# EAGLE board BoardSchem (EAGLE 9.6.2), part 1 of 4
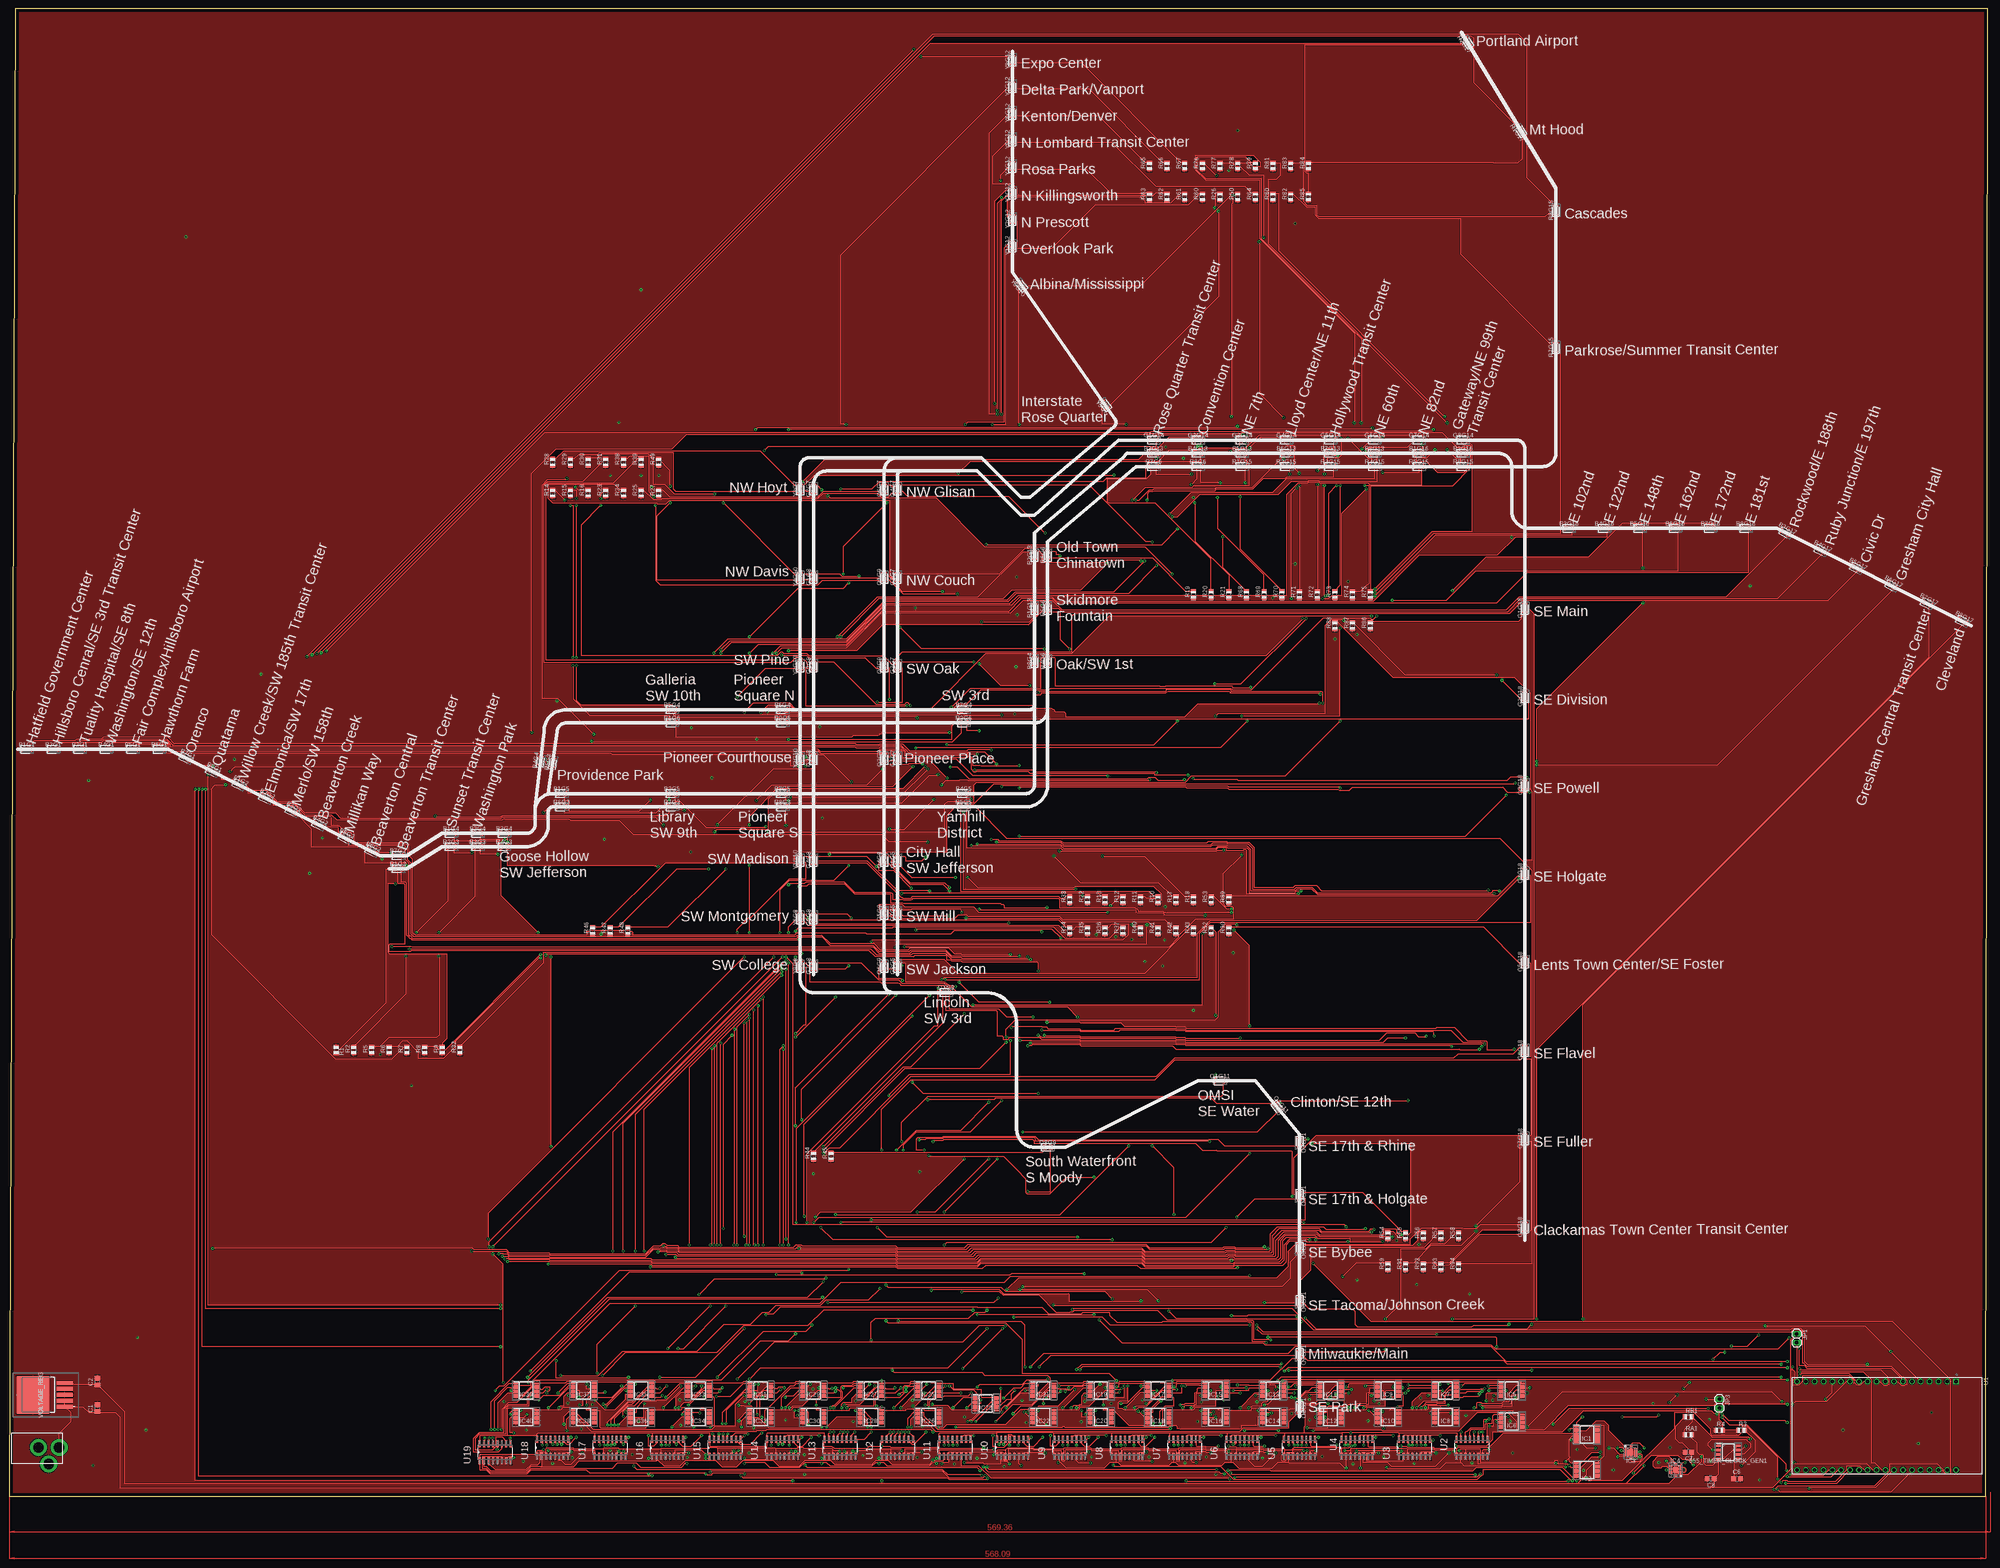
[diagram p22: board, top side]
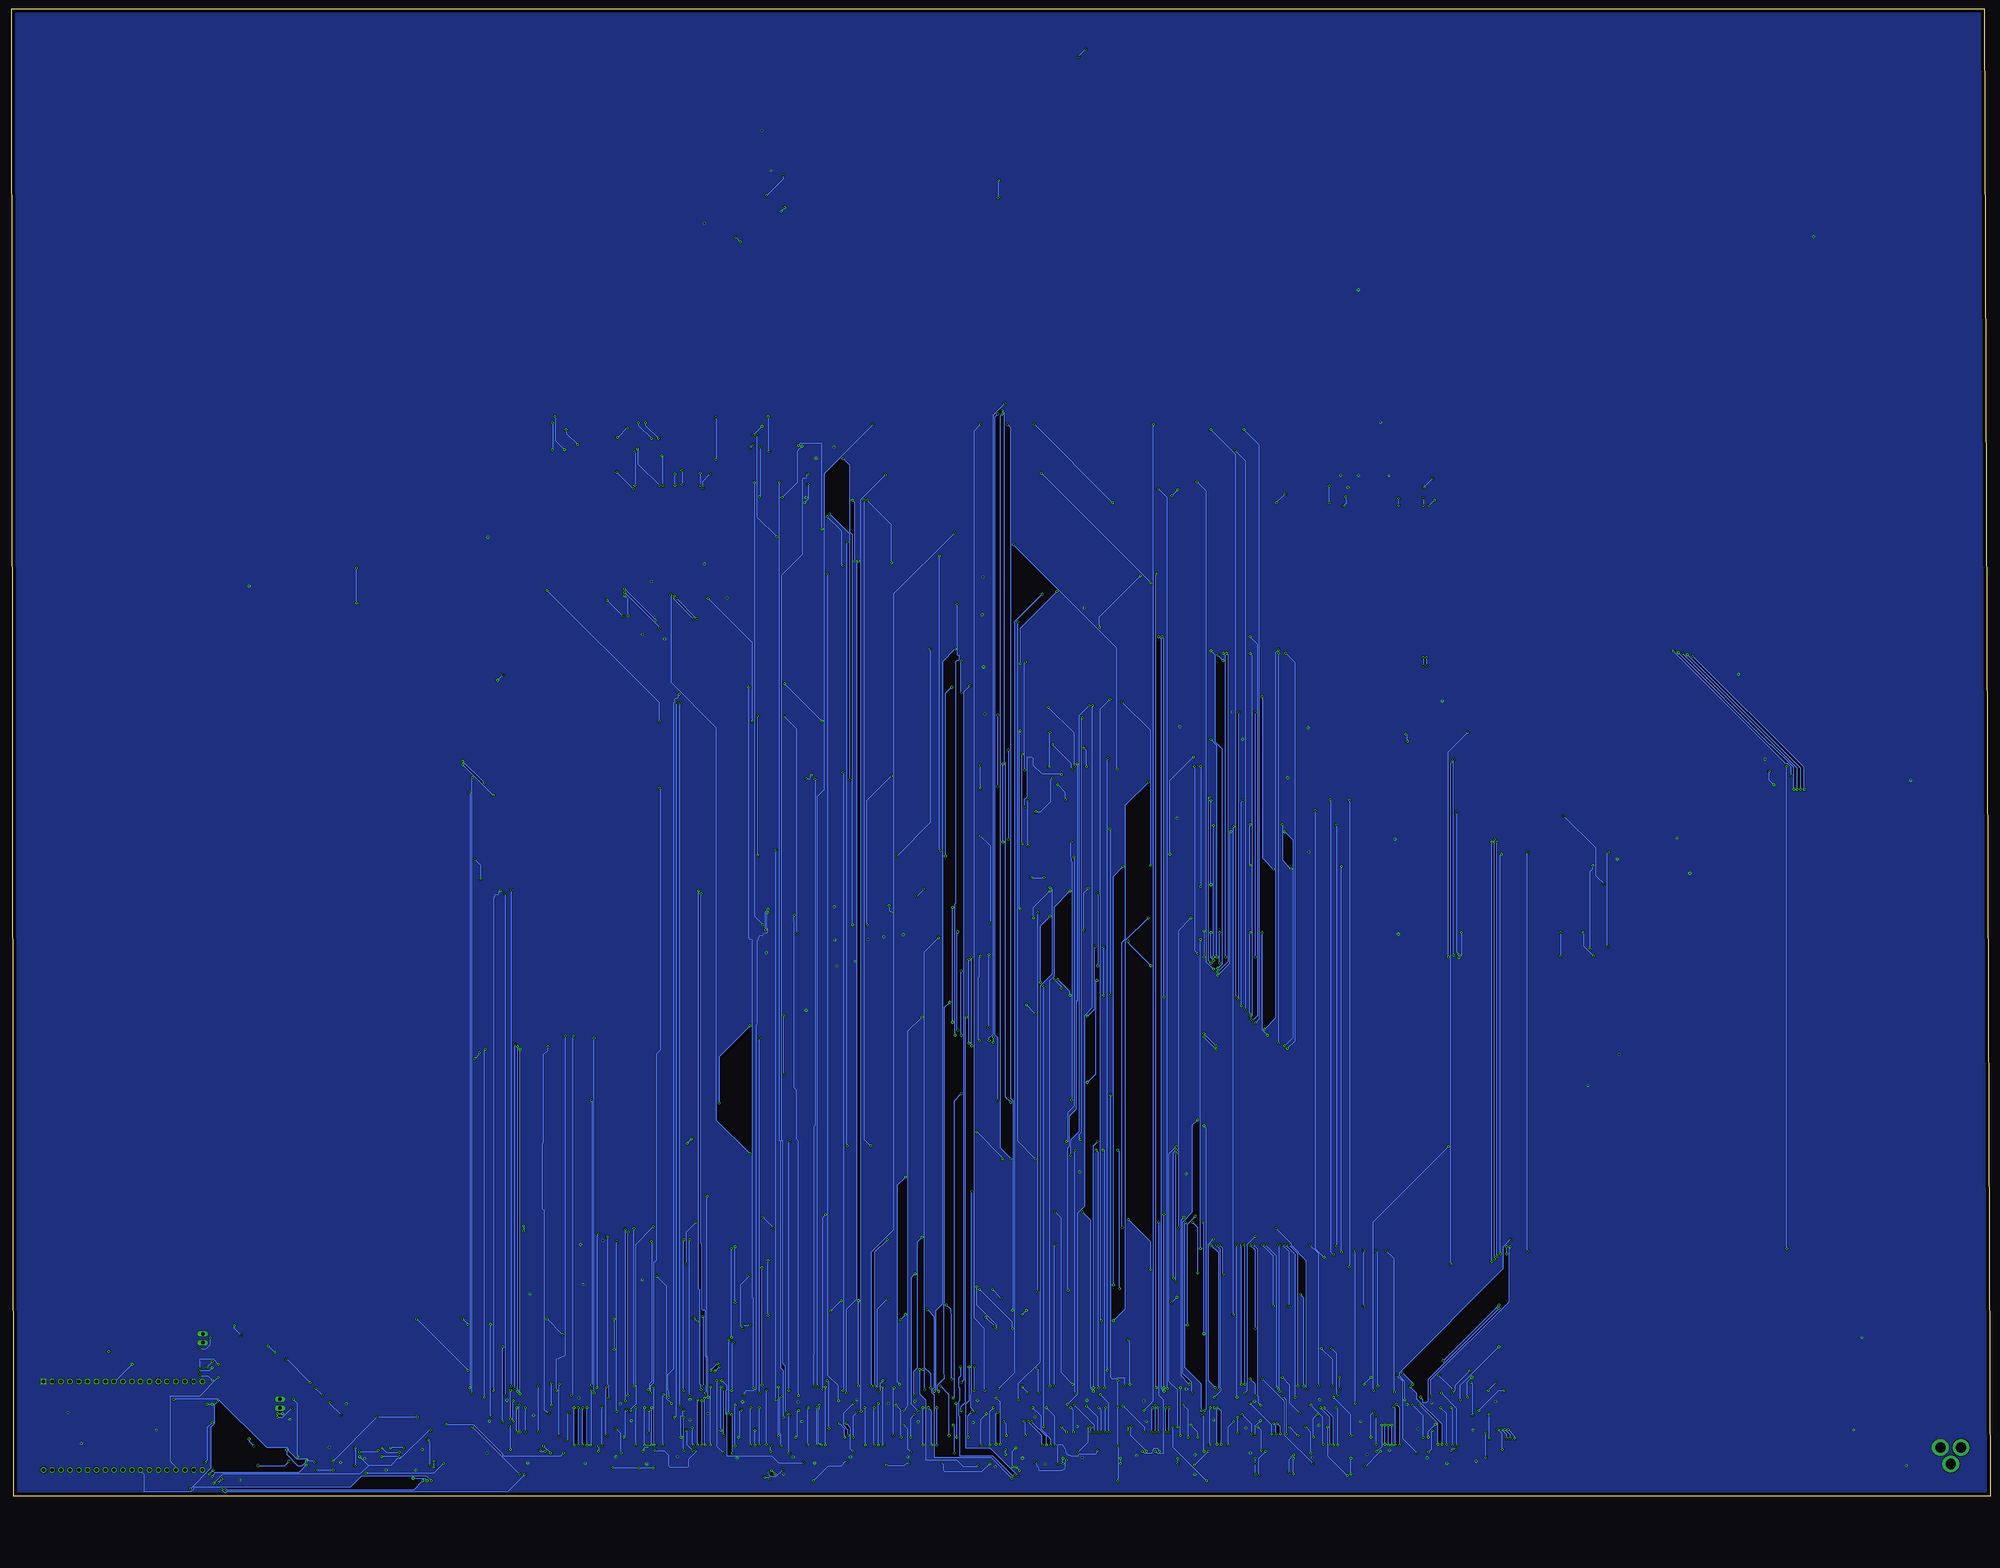
[diagram p23: board, bottom side, seen from below]

Size 568.62 x 427.45 mm. Coordinates in mm from the lower left corner, seen from the top.
Outline: 0,0 568.09,0 568.62,427.45 1.8,427.45 0,0
Copper layers (1*16): Top 0.035mm / dielectric 1.5mm / Bottom 0.035mm
Design rules "default": minimum track width 6mil, minimum drill 0.35mm, track to track 6mil, track to pad 6mil, pad to pad 6mil, via to via 6mil, smd to smd 6mil, copper to edge 40mil, drill to drill 6mil, minimum pad ring 10mil, minimum via ring 8mil, stop-mask expansion 4mil, vias tented up to drill 0mil, thermal gap 10mil
Net classes: 1 5v_power: width 1 mm

## Footprints (pad centres in the part's own frame; a part is rotated, then mirrored left to right if it is on the bottom)
SOIC127P600X175-8N = smd 1.528 x 0.65: 1 -2.711,1.905; 2 -2.711,0.635; 3 -2.711,-0.635; 4 -2.711,-1.905; 5 2.711,-1.905; 6 2.711,-0.635; 7 2.711,0.635; 8 2.711,1.905
LEDC2012X120N = smd 1 x 1.4: 1 -0.9,0; 2 0.9,0
PJ-102A = drill 3 pad 4.8: RING 0.1,-3.39; RING_SW -4.6,-6.29; TIP 0.1,-9.29
C0805 = smd 1.3 x 1.5: 1 -0.95,0; 2 0.95,0
SOP65P640X110-16N = smd 1.475 x 0.45: 1 -2.938,2.275; 2 -2.938,1.625; 3 -2.938,0.975; 4 -2.938,0.325; 5 -2.938,-0.325; 6 -2.938,-0.975; 7 -2.938,-1.625; 8 -2.938,-2.275; 9 2.938,-2.275; 10 2.938,-1.625; 11 2.938,-0.975; 12 2.938,-0.325; 13 2.938,0.325; 14 2.938,0.975; 15 2.938,1.625; 16 2.938,2.275
SOP65P640X110-14N = smd 1.475 x 0.45: 1 -2.938,1.95; 2 -2.938,1.3; 3 -2.938,0.65; 4 -2.938,0; 5 -2.938,-0.65; 6 -2.938,-1.3; 7 -2.938,-1.95; 8 2.938,-1.95; 9 2.938,-1.3; 10 2.938,-0.65; 11 2.938,0; 12 2.938,0.65; 13 2.938,1.3; 14 2.938,1.95
QFN50P250X300X100-15N = smd 0.85 x 0.3: 1 -1.2,1; 2 -1.2,0.5; 3 -1.2,0; 4 -1.2,-0.5; 5 -1.2,-1; 8 1.2,-1; 9 1.2,-0.5; 10 1.2,0; 11 1.2,0.5; 12 1.2,1 | smd 0.3 x 0.85: 6 -0.25,-1.45; 7 0.25,-1.45; 13 0.25,1.45; 14 -0.25,1.45 | smd 1.15 x 1.65: 15 0,0
1X02 = drill 1.016 long: 1 -1.27,0; 2 1.27,0
R0805 = smd 1.1 x 1.4: 1 -1,0; 2 1,0
MODULE_ESP32-DEVKITC-32D = drill 1.04 square: 1 -12.7,19.76 | drill 1.04: 2 -12.7,17.22; 3 -12.7,14.68; 4 -12.7,12.14; 5 -12.7,9.6; 6 -12.7,7.06; 7 -12.7,4.52; 8 -12.7,1.98; 9 -12.7,-0.56; 10 -12.7,-3.1; 11 -12.7,-5.64; 12 -12.7,-8.18; 13 -12.7,-10.72; 14 -12.7,-13.26; 15 -12.7,-15.8; 16 -12.7,-18.34; 17 -12.7,-20.88; 18 -12.7,-23.42; 19 -12.7,-25.96; 20 12.7,19.76; 21 12.7,17.22; 22 12.7,14.68; 23 12.7,12.14; 24 12.7,9.6; 25 12.7,7.06; 26 12.7,4.52; 27 12.7,1.98; 28 12.7,-0.56; 29 12.7,-3.1; 30 12.7,-5.64; 31 12.7,-8.18; 32 12.7,-10.72; 33 12.7,-13.26; 34 12.7,-15.8; 35 12.7,-18.34; 36 12.7,-20.88; 37 12.7,-23.42; 38 12.7,-25.96
SOIC127P600X175-16N = smd 1.981 x 0.559: 1 -2.464,4.445; 2 -2.464,3.175; 3 -2.464,1.905; 4 -2.464,0.635; 5 -2.464,-0.635; 6 -2.464,-1.905; 7 -2.464,-3.175; 8 -2.464,-4.445; 9 2.464,-4.445; 10 2.464,-3.175; 11 2.464,-1.905; 12 2.464,-0.635; 13 2.464,0.635; 14 2.464,1.905; 15 2.464,3.175; 16 2.464,4.445
TLS850B0TBV33ATMA1 = smd 1.1 x 4.6: 1 -3.4,-12.2; 2 -1.7,-12.2; 3 0,-12.2; 4 1.7,-12.2; 5 3.4,-12.2 | smd 10.8 x 9.4: 6 0,-3.05

## Placement (x,y rotation side)
555_TIMER_CLOCK_GEN1  LM555CM_NOPB  [SOIC127P600X175-8N]  494.03,12.7 0 top
B1G1  LTST-C170TBKT  [LEDC2012X120N]  5.08,214.63 0 top
B1G2  LTST-C170TBKT  [LEDC2012X120N]  66.04,204.47 333.5 top
B1G4  LTST-C170TBKT  [LEDC2012X120N]  127,190.5 0 top
B1G5  LTST-C170TBKT  [LEDC2012X120N]  158.75,201.93 0 top
B1G13  LTST-C170TBKT  [LEDC2012X120N]  294.64,255.27 90 top
B1G16  LTST-C170TBKT  [LEDC2012X120N]  405.13,299.72 0 top
B2G1  LTST-C170TBKT  [LEDC2012X120N]  12.7,214.63 0 top
B2G2  LTST-C170TBKT  [LEDC2012X120N]  73.66,200.66 333.5 top
B2G4  LTST-C170TBKT  [LEDC2012X120N]  134.62,190.5 0 top
B2G5  LTST-C170TBKT  [LEDC2012X120N]  190.5,201.93 0 top
B2G13  LTST-C170TBKT  [LEDC2012X120N]  294.64,270.51 90 top
B2G16  LTST-C170TBKT  [LEDC2012X120N]  417.83,299.72 0 top
B3G1  LTST-C170TBKT  [LEDC2012X120N]  20.32,214.63 0 top
B3G2  LTST-C170TBKT  [LEDC2012X120N]  81.28,196.85 333.5 top
B3G4  LTST-C170TBKT  [LEDC2012X120N]  142.24,190.5 0 top
B3G5  LTST-C170TBKT  [LEDC2012X120N]  222.25,201.93 0 top
B3G13  LTST-C170TBKT  [LEDC2012X120N]  328.93,299.72 0 top
B3G16  LTST-C170TBKT  [LEDC2012X120N]  448.31,278.13 0 top
B3G17  LTST-C170TBKT  [LEDC2012X120N]  510.54,276.86 332.9 top
B4G1  LTST-C170TBKT  [LEDC2012X120N]  27.94,214.63 0 top
B4G2  LTST-C170TBKT  [LEDC2012X120N]  88.9,193.04 333.5 top
B4G4  LTST-C170TBKT  [LEDC2012X120N]  152.69,211.32 82.3 top
B4G5  LTST-C170TBKT  [LEDC2012X120N]  274.32,201.93 0 top
B4G13  LTST-C170TBKT  [LEDC2012X120N]  341.63,299.72 0 top
B4G16  LTST-C170TBKT  [LEDC2012X120N]  458.47,278.13 0 top
B4G17  LTST-C170TBKT  [LEDC2012X120N]  520.7,271.78 332.9 top
B5G1  LTST-C170TBKT  [LEDC2012X120N]  35.56,214.63 0 top
B5G2  LTST-C170TBKT  [LEDC2012X120N]  96.52,189.23 333.5 top
B5G4  LTST-C170TBKT  [LEDC2012X120N]  190.5,226.06 0 top
B5G13  LTST-C170TBKT  [LEDC2012X120N]  354.33,299.72 0 top
B5G16  LTST-C170TBKT  [LEDC2012X120N]  468.63,278.13 0 top
B5G17  LTST-C170TBKT  [LEDC2012X120N]  530.86,266.7 332.9 top
B6G1  LTST-C170TBKT  [LEDC2012X120N]  43.18,214.63 0 top
B6G2  LTST-C170TBKT  [LEDC2012X120N]  104.14,185.42 333.5 top
B6G4  LTST-C170TBKT  [LEDC2012X120N]  222.25,226.06 0 top
B6G13  LTST-C170TBKT  [LEDC2012X120N]  367.03,299.72 0 top
B6G16  LTST-C170TBKT  [LEDC2012X120N]  478.79,278.13 0 top
B6G17  LTST-C170TBKT  [LEDC2012X120N]  541.02,261.62 332.9 top
B7G1  LTST-C170TBKT  [LEDC2012X120N]  50.8,212.09 333.5 top
B7G2  LTST-C170TBKT  [LEDC2012X120N]  111.76,184.15 0 top
B7G4  LTST-C170TBKT  [LEDC2012X120N]  274.32,226.06 0 top
B7G13  LTST-C170TBKT  [LEDC2012X120N]  379.73,299.72 0 top
B7G16  LTST-C170TBKT  [LEDC2012X120N]  488.95,278.13 0 top
B7G17  LTST-C170TBKT  [LEDC2012X120N]  551.18,256.54 332.9 top
B8G1  LTST-C170TBKT  [LEDC2012X120N]  58.42,208.28 333.5 top
B8G4  LTST-C170TBKT  [LEDC2012X120N]  294.64,240.03 90 top
B8G13  LTST-C170TBKT  [LEDC2012X120N]  392.43,299.72 0 top
B8G16  LTST-C170TBKT  [LEDC2012X120N]  499.11,278.13 0 top
B8G17  LTST-C170TBKT  [LEDC2012X120N]  561.34,251.46 332.9 top
BARREL_JACK1  2.1MMJACKTHM  [PJ-102A]  5.08,13.97 90 top
C1  .1uF  [C0805]  25.4,25.4 90 top
C2  2.2uF  [C0805]  25.4,33.02 90 top
C6  .01uF  [C0805]  496.57,5.08 0 top
C7  [C0805]  482.6,12.7 180 top
C8  .1uF  [C0805]  488.95,5.08 180 top
G1G7  LTST-C170TBKT  [LEDC2012X120N]  255.27,212.09 90 top
G1G8  LTST-C170TBKT  [LEDC2012X120N]  231.14,264.16 90 top
G1G14  LTST-C170TBKT  [LEDC2012X120N]  328.93,303.53 0 top
G1G18  LTST-C170TBKT  [LEDC2012X120N]  435.61,255.27 90 top
G2G7  LTST-C170TBKT  [LEDC2012X120N]  255.27,238.76 90 top
G2G8  LTST-C170TBKT  [LEDC2012X120N]  231.14,238.76 90 top
G2G14  LTST-C170TBKT  [LEDC2012X120N]  341.63,303.53 0 top
G2G18  LTST-C170TBKT  [LEDC2012X120N]  435.61,229.87 90 top
G3G7  LTST-C170TBKT  [LEDC2012X120N]  255.27,264.16 90 top
G3G8  LTST-C170TBKT  [LEDC2012X120N]  231.14,212.09 90 top
G3G14  LTST-C170TBKT  [LEDC2012X120N]  354.33,303.53 0 top
G3G18  LTST-C170TBKT  [LEDC2012X120N]  435.61,204.47 90 top
G4G7  LTST-C170TBKT  [LEDC2012X120N]  255.27,289.56 90 top
G4G8  LTST-C170TBKT  [LEDC2012X120N]  231.14,182.88 90 top
G4G14  LTST-C170TBKT  [LEDC2012X120N]  367.03,303.53 0 top
G4G18  LTST-C170TBKT  [LEDC2012X120N]  435.61,179.07 90 top
G5G8  LTST-C170TBKT  [LEDC2012X120N]  231.14,166.37 90 top
G5G14  LTST-C170TBKT  [LEDC2012X120N]  379.73,303.53 0 top
G5G18  LTST-C170TBKT  [LEDC2012X120N]  435.61,153.67 90 top
G6G5  LTST-C170TBKT  [LEDC2012X120N]  255.27,182.88 90 top
G6G14  LTST-C170TBKT  [LEDC2012X120N]  392.43,303.53 0 top
G6G18  LTST-C170TBKT  [LEDC2012X120N]  435.61,128.27 90 top
G7G5  LTST-C170TBKT  [LEDC2012X120N]  255.27,167.64 90 top
G7G7  LTST-C170TBKT  [LEDC2012X120N]  231.14,289.56 90 top
G7G8  LTST-C170TBKT  [LEDC2012X120N]  231.14,152.4 90 top
G7G14  LTST-C170TBKT  [LEDC2012X120N]  405.13,303.53 0 top
G7G18  LTST-C170TBKT  [LEDC2012X120N]  435.61,102.87 90 top
G8G5  LTST-C170TBKT  [LEDC2012X120N]  255.27,152.4 90 top
G8G14  LTST-C170TBKT  [LEDC2012X120N]  417.83,303.53 0 top
G8G18  LTST-C170TBKT  [LEDC2012X120N]  435.61,77.47 90 top
IC1  74HC390PW,118  [SOP65P640X110-16N]  453.39,17.78 0 top
IC2  74ALVC04PW,118  [SOP65P640X110-14N]  453.39,7.62 0 top
IC3  74ALVC08BQ,115  [QFN50P250X300X100-15N]  466.09,12.7 0 top
IC4  74ALVC08BQ,115  [QFN50P250X300X100-15N]  478.79,7.62 180 top
IC5  74ALVC04PW,118  [SOP65P640X110-14N]  431.8,30.48 0 top
IC6  74ALVC04PW,118  [SOP65P640X110-14N]  431.8,21.59 0 top
IC7  74ALVC04PW,118  [SOP65P640X110-14N]  412.75,30.48 0 top
IC8  74ALVC04PW,118  [SOP65P640X110-14N]  412.75,22.86 0 top
IC9  74ALVC04PW,118  [SOP65P640X110-14N]  396.24,30.48 0 top
IC10  74ALVC04PW,118  [SOP65P640X110-14N]  396.24,22.86 0 top
IC11  74ALVC04PW,118  [SOP65P640X110-14N]  379.73,30.48 0 top
IC12  74ALVC04PW,118  [SOP65P640X110-14N]  379.73,22.86 0 top
IC13  74ALVC04PW,118  [SOP65P640X110-14N]  363.22,30.48 0 top
IC14  74ALVC04PW,118  [SOP65P640X110-14N]  363.22,22.86 0 top
IC15  74ALVC04PW,118  [SOP65P640X110-14N]  346.71,30.48 0 top
IC16  74ALVC04PW,118  [SOP65P640X110-14N]  346.71,22.86 0 top
IC17  74ALVC04PW,118  [SOP65P640X110-14N]  330.2,30.48 0 top
IC18  74ALVC04PW,118  [SOP65P640X110-14N]  330.2,22.86 0 top
IC19  74ALVC04PW,118  [SOP65P640X110-14N]  313.69,30.48 0 top
IC20  74ALVC04PW,118  [SOP65P640X110-14N]  313.69,22.86 0 top
IC21  74ALVC04PW,118  [SOP65P640X110-14N]  297.18,30.48 0 top
IC22  74ALVC04PW,118  [SOP65P640X110-14N]  297.18,22.86 0 top
IC23  74ALVC04PW,118  [SOP65P640X110-14N]  280.67,26.67 0 top
IC25  74ALVC04PW,118  [SOP65P640X110-14N]  264.16,30.48 0 top
IC26  74ALVC04PW,118  [SOP65P640X110-14N]  264.16,22.86 0 top
IC27  74ALVC04PW,118  [SOP65P640X110-14N]  247.65,30.48 0 top
IC28  74ALVC04PW,118  [SOP65P640X110-14N]  247.65,22.86 0 top
IC29  74ALVC04PW,118  [SOP65P640X110-14N]  231.14,30.48 0 top
IC30  74ALVC04PW,118  [SOP65P640X110-14N]  231.14,22.86 0 top
IC31  74ALVC04PW,118  [SOP65P640X110-14N]  215.9,30.48 0 top
IC32  74ALVC04PW,118  [SOP65P640X110-14N]  215.9,22.86 0 top
IC33  74ALVC04PW,118  [SOP65P640X110-14N]  198.12,30.48 0 top
IC34  74ALVC04PW,118  [SOP65P640X110-14N]  198.12,22.86 0 top
IC35  74ALVC04PW,118  [SOP65P640X110-14N]  181.61,30.48 0 top
IC36  74ALVC04PW,118  [SOP65P640X110-14N]  181.61,22.86 0 top
IC37  74ALVC04PW,118  [SOP65P640X110-14N]  165.1,30.48 0 top
IC38  74ALVC04PW,118  [SOP65P640X110-14N]  165.1,22.86 0 top
IC39  74ALVC04PW,118  [SOP65P640X110-14N]  148.59,30.48 0 top
IC40  74ALVC04PW,118  [SOP65P640X110-14N]  148.59,22.86 0 top
JP1  [1X02]  513.72,45.47 270 top
JP3  [1X02]  491.49,26.67 270 top
O1G9  LTST-C170TBKT  [LEDC2012X120N]  251.46,264.16 90 top
O1G11  LTST-C170TBKT  [LEDC2012X120N]  347.98,119.38 0 top
O2G9  LTST-C170TBKT  [LEDC2012X120N]  251.46,238.76 90 top
O2G11  LTST-C170TBKT  [LEDC2012X120N]  364.49,111.76 308.9 top
O3G9  LTST-C170TBKT  [LEDC2012X120N]  251.46,212.09 90 top
O3G11  LTST-C170TBKT  [LEDC2012X120N]  370.84,101.6 270 top
O4G9  LTST-C170TBKT  [LEDC2012X120N]  251.46,182.88 90 top
O4G11  LTST-C170TBKT  [LEDC2012X120N]  370.84,86.36 270 top
O5G9  LTST-C170TBKT  [LEDC2012X120N]  251.46,167.64 90 top
O5G11  LTST-C170TBKT  [LEDC2012X120N]  370.84,71.12 270 top
O6G7  LTST-C170TBKT  [LEDC2012X120N]  251.46,289.56 90 top
O6G9  LTST-C170TBKT  [LEDC2012X120N]  251.46,152.4 90 top
O6G11  LTST-C170TBKT  [LEDC2012X120N]  370.84,55.88 270 top
O7G9  LTST-C170TBKT  [LEDC2012X120N]  269.24,144.78 0 top
O7G11  LTST-C170TBKT  [LEDC2012X120N]  370.84,40.64 270 top
O8G9  LTST-C170TBKT  [LEDC2012X120N]  298.45,100.33 0 top
O8G11  LTST-C170TBKT  [LEDC2012X120N]  370.84,25.4 270 top
R1  50  [R0805]  93.98,128.27 270 top
R1G3  LTST-C170TBKT  [LEDC2012X120N]  111.76,180.34 0 top
R1G6  LTST-C170TBKT  [LEDC2012X120N]  190.5,222.25 0 top
R1G15  LTST-C170TBKT  [LEDC2012X120N]  354.33,295.91 0 top
R1G17  LTST-C170TBKT  [LEDC2012X120N]  434.34,392.43 124.3 top
R2  50  [R0805]  99.06,128.27 90 top
R2G3  LTST-C170TBKT  [LEDC2012X120N]  127,186.69 0 top
R2G6  LTST-C170TBKT  [LEDC2012X120N]  222.25,222.25 0 top
R2G15  LTST-C170TBKT  [LEDC2012X120N]  367.03,295.91 0 top
R2G17  LTST-C170TBKT  [LEDC2012X120N]  419.1,417.83 124.2 top
R3  50  [R0805]  497.84,19.05 0 top
R3G3  LTST-C170TBKT  [LEDC2012X120N]  134.62,186.69 0 top
R3G6  LTST-C170TBKT  [LEDC2012X120N]  274.32,222.25 0 top
R3G15  LTST-C170TBKT  [LEDC2012X120N]  379.73,295.91 0 top
R4  128  [R0805]  491.49,19.05 0 top
R4G3  LTST-C170TBKT  [LEDC2012X120N]  142.24,186.69 0 top
R4G6  LTST-C170TBKT  [LEDC2012X120N]  298.45,240.03 90 top
R4G15  LTST-C170TBKT  [LEDC2012X120N]  392.43,295.91 0 top
R5  50  [R0805]  104.14,128.27 90 top
R5G3  LTST-C170TBKT  [LEDC2012X120N]  156.21,210.82 81.1 top
R5G5  LTST-C170TBKT  [LEDC2012X120N]  274.32,198.12 0 top
R5G6  LTST-C170TBKT  [LEDC2012X120N]  298.45,255.27 90 top
R5G15  LTST-C170TBKT  [LEDC2012X120N]  405.13,295.91 0 top
R6  50  [R0805]  109.22,128.27 90 top
R6G3  LTST-C170TBKT  [LEDC2012X120N]  158.75,198.12 0 top
R6G6  LTST-C170TBKT  [LEDC2012X120N]  298.45,270.51 90 top
R6G15  LTST-C170TBKT  [LEDC2012X120N]  417.83,295.91 0 top
R7  50  [R0805]  114.3,128.27 90 top
R7G3  LTST-C170TBKT  [LEDC2012X120N]  190.5,198.12 0 top
R7G6  LTST-C170TBKT  [LEDC2012X120N]  328.93,295.91 0 top
R7G15  LTST-C170TBKT  [LEDC2012X120N]  444.5,330.2 90 top
R8  50  [R0805]  119.38,128.27 90 top
R8G3  LTST-C170TBKT  [LEDC2012X120N]  222.25,198.12 0 top
R8G6  LTST-C170TBKT  [LEDC2012X120N]  341.63,295.91 0 top
R8G15  LTST-C170TBKT  [LEDC2012X120N]  444.5,369.57 90 top
R9  50  [R0805]  124.46,128.27 90 top
R10  50  [R0805]  330.2,171.45 90 top
R11  50  [R0805]  325.12,171.45 90 top
R12  50  [R0805]  320.04,171.45 90 top
R13  50  [R0805]  314.96,171.45 90 top
R14  50  [R0805]  156.21,288.29 90 top
R15  50  [R0805]  161.29,288.29 90 top
R16  50  [R0805]  166.37,288.29 90 top
R17  50  [R0805]  335.28,171.45 90 top
R18  50  [R0805]  340.36,171.45 90 top
R19  50  [R0805]  340.36,259.08 90 top
R20  50  [R0805]  345.44,259.08 90 top
R21  50  [R0805]  350.52,259.08 90 top
R22  50  [R0805]  309.88,171.45 90 top
R23  50  [R0805]  171.45,288.29 90 top
R24  50  [R0805]  176.53,288.29 90 top
R25  50  [R0805]  181.61,288.29 90 top
R26  50  [R0805]  347.98,373.38 90 top
R27  50  [R0805]  186.69,288.29 90 top
R28  50  [R0805]  156.21,297.18 90 top
R29  50  [R0805]  161.29,297.18 90 top
R30  50  [R0805]  166.37,297.18 90 top
R31  50  [R0805]  171.45,297.18 90 top
R32  50  [R0805]  129.54,128.27 90 top
R33  50  [R0805]  304.8,171.45 90 top
R34  50  [R0805]  304.8,162.56 90 top
R35  50  [R0805]  309.88,162.56 90 top
R36  50  [R0805]  314.96,162.56 90 top
R37  50  [R0805]  320.04,162.56 90 top
R38  50  [R0805]  176.53,297.18 90 top
R39  50  [R0805]  181.61,297.18 90 top
R40  50  [R0805]  325.12,162.56 90 top
R41  50  [R0805]  330.2,162.56 90 top
R42  50  [R0805]  335.28,162.56 90 top
R43  50  [R0805]  340.36,162.56 90 top
R44  50  [R0805]  231.14,97.79 90 top
R45  50  [R0805]  236.22,97.79 90 top
R46  50  [R0805]  167.64,162.56 90 top
R47  50  [R0805]  172.72,162.56 90 top
R48  50  [R0805]  177.8,162.56 90 top
R49  50  [R0805]  186.69,297.18 90 top
R50  50  [R0805]  353.06,373.38 90 top
R52  50  [R0805]  345.44,162.56 90 top
R53  50  [R0805]  345.44,171.45 90 top
R54  50  [R0805]  396.24,74.93 90 top
R55  50  [R0805]  401.32,74.93 90 top
R56  50  [R0805]  406.4,74.93 90 top
R57  50  [R0805]  411.48,74.93 90 top
R58  50  [R0805]  416.56,74.93 90 top
R59  50  [R0805]  396.24,66.04 90 top
R60  50  [R0805]  342.9,373.38 90 top
R61  50  [R0805]  337.82,373.38 90 top
R62  50  [R0805]  332.74,373.38 90 top
R63  50  [R0805]  327.66,373.38 90 top
R64  50  [R0805]  358.14,373.38 90 top
R65  50  [R0805]  327.66,382.27 90 top
R66  50  [R0805]  332.74,382.27 90 top
R67  50  [R0805]  337.82,382.27 90 top
R68  50  [R0805]  355.6,259.08 90 top
R69  50  [R0805]  360.68,259.08 90 top
R70  50  [R0805]  365.76,259.08 90 top
R71  50  [R0805]  370.84,259.08 90 top
R72  50  [R0805]  375.92,259.08 90 top
R73  50  [R0805]  381,259.08 90 top
R74  50  [R0805]  386.08,259.08 90 top
R75  50  [R0805]  391.16,259.08 90 top
R76  50  [R0805]  342.9,382.27 90 top
R77  50  [R0805]  347.98,382.27 90 top
R78  50  [R0805]  353.06,382.27 90 top
R79  50  [R0805]  358.14,382.27 90 top
R80  50  [R0805]  363.22,373.38 90 top
R81  50  [R0805]  363.22,382.27 90 top
R82  50  [R0805]  368.3,373.38 90 top
R83  50  [R0805]  368.3,382.27 90 top
R84  50  [R0805]  373.38,382.27 90 top
R85  50  [R0805]  373.38,373.38 90 top
R86  50  [R0805]  391.16,250.19 90 top
R87  50  [R0805]  386.08,250.19 90 top
R88  50  [R0805]  381,250.19 90 top
R89  50  [R0805]  350.52,171.45 90 top
R90  50  [R0805]  350.52,162.56 90 top
R91  50  [R0805]  401.32,66.04 90 top
R92  50  [R0805]  406.4,66.04 90 top
R93  50  [R0805]  411.48,66.04 90 top
R94  50  [R0805]  416.56,66.04 90 top
RA1  [R0805]  482.6,17.78 0 top
RB1  [R0805]  482.6,22.86 0 top
U1  ESP32-DEVKITC-32D  [MODULE_ESP32-DEVKITC-32D]  539.75,20.32 270 top
U2  74LCX138MX  [SOIC127P600X175-16N]  420.37,13.97 90 top
U3  74LCX138MX  [SOIC127P600X175-16N]  403.86,13.97 90 top
U4  74LCX138MX  [SOIC127P600X175-16N]  387.35,13.97 90 top
U5  74LCX138MX  [SOIC127P600X175-16N]  370.84,13.97 90 top
U6  74LCX138MX  [SOIC127P600X175-16N]  354.33,13.97 90 top
U7  74LCX138MX  [SOIC127P600X175-16N]  337.82,13.97 90 top
U8  74LCX138MX  [SOIC127P600X175-16N]  321.31,13.97 90 top
U9  74LCX138MX  [SOIC127P600X175-16N]  304.8,13.97 90 top
U10  74LCX138MX  [SOIC127P600X175-16N]  288.29,13.97 90 top
U11  74LCX138MX  [SOIC127P600X175-16N]  271.78,13.97 90 top
U12  74LCX138MX  [SOIC127P600X175-16N]  255.27,13.97 90 top
U13  74LCX138MX  [SOIC127P600X175-16N]  238.76,13.97 90 top
U14  74LCX138MX  [SOIC127P600X175-16N]  222.25,13.97 90 top
U15  74LCX138MX  [SOIC127P600X175-16N]  205.74,13.97 90 top
U16  74LCX138MX  [SOIC127P600X175-16N]  189.23,13.97 90 top
U17  74LCX138MX  [SOIC127P600X175-16N]  172.72,13.97 90 top
U18  74LCX138MX  [SOIC127P600X175-16N]  156.21,13.97 90 top
U19  74LCX138MX  [SOIC127P600X175-16N]  139.7,12.7 90 top
VOLTAGE_REG  TLS850B0TBV33ATMA1  [TLS850B0TBV33ATMA1]  3.81,29.21 90 top
Y1G10  LTST-C170TBKT  [LEDC2012X120N]  227.33,182.88 90 top
Y1G12  LTST-C170TBKT  [LEDC2012X120N]  288.29,359.41 90 top
Y2G10  LTST-C170TBKT  [LEDC2012X120N]  227.33,212.09 90 top
Y2G12  LTST-C170TBKT  [LEDC2012X120N]  288.29,367.03 90 top
Y3G10  LTST-C170TBKT  [LEDC2012X120N]  227.33,238.76 90 top
Y3G12  LTST-C170TBKT  [LEDC2012X120N]  288.29,374.65 90 top
Y4G10  LTST-C170TBKT  [LEDC2012X120N]  227.33,264.16 90 top
Y4G12  LTST-C170TBKT  [LEDC2012X120N]  288.29,382.27 90 top
Y5G7  LTST-C170TBKT  [LEDC2012X120N]  314.96,313.69 127.7 top
Y5G10  LTST-C170TBKT  [LEDC2012X120N]  290.83,347.98 127.7 top
Y5G12  LTST-C170TBKT  [LEDC2012X120N]  288.29,389.89 90 top
Y6G8  LTST-C170TBKT  [LEDC2012X120N]  227.33,166.37 90 top
Y6G12  LTST-C170TBKT  [LEDC2012X120N]  288.29,397.51 90 top
Y7G12  LTST-C170TBKT  [LEDC2012X120N]  288.29,405.13 90 top
Y8G7  LTST-C170TBKT  [LEDC2012X120N]  227.33,289.56 90 top
Y8G8  LTST-C170TBKT  [LEDC2012X120N]  227.33,152.4 90 top
Y8G12  LTST-C170TBKT  [LEDC2012X120N]  288.29,412.75 90 top

## Tracks (layer width: path | path; a pad name or v marks a point on that pad's centre or on a via)
+3V3  (via drill 0.35)
  Top 0.152: 250.75,3.81 33.02,3.81 33.02,24.45 C2.1 18.73,32.07 18.27,32.52 18.25,32.5 16.25,32.5 VOLTAGE_REG.5 | 250.75,3.81 450.85,3.81 | 450.85,3.81 453.39,6.35 453.39,7.62 455.34,9.57 IC2.14 458.47,11.71 458.47,20.32 456.59,20.32 IC1.16 | IC4.14 478.92,6.05 478.92,5.65 477.08,3.81 464.82,3.81 | 450.85,3.81 464.82,3.81 | 464.82,3.81 v469.9,8.89 | IC3.14 465.96,14.27 465.96,14.67 466.53,15.24 468.63,15.24 v469.9,13.97 | IC21.14 300.25,32.5 308.5,32.5 308.75,32.75 308.75,33 314.25,33 314.5,32.75 314.5,32.5 316.5,32.5 IC19.14 316.75,32.5 318.75,32.5 319,32.75 319,33 330.75,33 331,32.75 331,32.5 333,32.5 IC17.14 333.25,32.5 335.25,32.5 335.5,32.75 335.5,33 349,33 | 349,33 349.25,32.75 349.25,32.5 349.5,32.5 IC15.14 | 349,33 362.5,33 362.5,32.75 362.75,32.5 366,32.5 IC13.14 366.25,32.5 366.5,32.5 366.5,32.75 366.75,33 382.5,33 | 382.5,33 382.5,32.5 IC11.14 | 399,33 399,32.5 IC9.14 | 382.5,33 399,33 | 415.5,33 415.5,32.5 | 399,33 415.5,33 | 415.5,33 434.5,33 434.5,32.5 IC5.14 | IC22.14 300.25,24.75 307.25,24.75 307.5,25 307.5,25.25 307.75,25.5 314.25,25.5 314.5,25.25 314.5,24.75 316.5,24.75 IC20.14 316.75,24.75 317.5,24.75 322,20.25 331.25,20.25 331.5,20.5 331.5,24.75 333,24.75 IC18.14 333.25,24.75 340.25,24.75 340.5,25 340.5,25.25 340.75,25.5 347.25,25.5 347.5,25.25 347.5,24.75 349.5,24.75 IC16.14 349.75,24.75 357,24.75 357,25.25 357.25,25.5 361.75,25.5 361.75,25 362,24.75 366,24.75 IC14.14 366.25,24.75 367.75,24.75 368,25 369.75,25 370,25.25 371.75,25.25 372,25 372.25,25 372.5,24.75 372.5,20.25 372.25,20 372.25,18.25 | IC12.14 382.75,24.75 v385.5,24.75 389.75,24.75 390,25 390,25.25 390.25,25.5 396.75,25.5 397,25.25 397,24.75 399,24.75 IC10.14 399.25,24.75 407.5,24.75 407.75,25 407.75,26 411.25,26
  Top 0.152: IC6.14 434.5,23.5 432.25,23.5 432,23.75 432,24.75 415.75,24.75 IC8.14 415.5,24.75 411.5,24.75 411.5,25.75 411.25,26 | 383,18.25 383,16.5 U4.16 | 399.25,18.25 v385.5,18.25 383,18.25 | 399.25,18.25 399.5,18 399.5,16.5 U3.16 | 399.25,18.25 416,18.25 416,16.5 U2.16 | 283.75,18.25 283.75,16.5 U10.16 | 300,18.25 283.75,18.25 | 300,18.25 300.25,18 300.25,16.5 U9.16 | 316.75,18.25 316.75,16.5 U8.16 | 300,18.25 316.75,18.25 | 333.5,18.25 333.5,16.5 U7.16 | 316.75,18.25 333.5,18.25 | 350,18.25 350,16.5 U6.16 | 333.5,18.25 350,18.25 | 366.5,18.25 366.5,16.5 U5.16 | 350,18.25 366.5,18.25 | 366.5,18.25 372.25,18.25 | 372.25,18.25 383,18.25 | v413.5,32.5 415.5,32.5 | v413.5,26.25 411.5,26.25 411.25,26 | 415.5,32.5 IC7.14 | 167.5,33 160.25,33 159.75,32.5 151.75,32.5 IC39.14 | 167.5,33 167.75,32.75 167.75,32.5 168,32.5 IC37.14 | 184.5,33 184.5,32.5 IC35.14 | 167.5,33 184.5,33 | 184.5,33 196.75,33 197,32.75 197.25,32.75 197.5,32.5 201,32.5 IC33.14 201.25,32.5 210.5,32.5 211,33 216.5,33 216.75,32.75 216.75,32.5 218.75,32.5 IC31.14 219,32.5 225.75,32.5 226,32.75 226,33 231.75,33 232,32.75 232,32.5 234,32.5 IC29.14 234.25,32.5 242.25,32.5 242.5,32.75 242.5,33 248.25,33 248.5,32.75 248.5,32.5 250.5,32.5 IC27.14 250.75,32.5 | 250.75,32.5 258.75,32.5 259,32.75 259,33 264.75,33 265,32.75 265,32.5 267,32.5 IC25.14 267.25,32.5 271.25,32.5 271.25,31.25 271.5,31 277.75,31 278,30.75 279.25,30.75 279.25,28.75 279.5,28.5 283.5,28.5 IC23.14 | IC34.14 201,24.75 198.75,24.75 198.75,25.25 198.5,25.5 193.25,25.5 193.25,25 193,24.75 184.75,24.75 IC36.14 184.5,24.75 183.25,24.75 183,24.5 183,19.75 170,19.75 169.75,20 169.75,24.75 168.25,24.75 IC38.14 168,24.75 166,24.75 166,25.25 165.75,25.5 159,25.5 158.75,25.25 158.75,25 158.5,24.75 151.75,24.75 IC40.14 151.5,25 151.25,25.25 149.75,25.25 149.5,25.5 143.5,25.5 143.25,25.25 143.25,17.5
  Top 0.152: 151.5,17.5 143.25,17.5 | 143.25,17.5 135.25,17.5 135.25,15.25 U19.16 | 151.5,17.5 151.75,17.25 151.75,16.5 U18.16 | 168.25,18.25 168.25,16.5 U17.16 | 168.25,18.25 152,18.25 151.75,18 151.75,17.5 151.5,17.5 | 184.75,18.25 184.75,16.5 U16.16 | 168.25,18.25 184.75,18.25 | 184.75,18.25 201.25,18.25 201.25,16.5 U15.16 201.25,16.25 201.25,14.75 201.5,14.5 217.75,14.5 217.75,16.25 U14.16 217.75,16.5 217.75,18 218,18.25 234.25,18.25 234.25,16.5 U13.16 234.25,16.25 234.25,14.25 236.5,14.25 236.75,14 237,14 237.25,13.75 246.5,13.75 247,14.25 250.75,14.25 | IC32.14 219,24.75 224.75,24.75 225,25 225,25.25 225.25,25.5 231.75,25.5 232,25.25 232,24.75 234,24.75 IC30.14 234.25,24.75 241.5,24.75 241.5,25.25 241.75,25.5 248.5,25.5 248.75,25.25 250.25,25.25 | 250.25,25.25 250.5,25 IC28.14 250.75,24.75 257.75,24.75 257.75,25 258,25.25 260,25.25 260.25,25.5 262.75,25.5 262.75,25 263,24.75 267,24.75 IC26.14 | 250.75,14.25 253.25,14.25 253.5,14 267,14 267.25,14.25 267.25,16.25 U11.16 267.25,16.5 267.25,18 267.5,18.25 283.75,18.25 | U12.16 250.75,16.25 v250.75,14.5 250.75,14.25 | v250.75,4.5 250.75,3.81 | 250.25,25.25 250.25,25.75 v250.75,25.75 | v250.75,33.25 250.75,32.5
  Bottom 0.152: v469.9,13.97 v469.9,8.89 | v385.5,24.75 385.25,24.5 385.25,18.5 v385.5,18.25 | v413.5,26.25 v413.5,32.5 | v250.75,4.5 v250.75,14.5 v250.75,25.75 v250.75,33.25
+5V
  Top 0.152: 555_TIMER_CLOCK_GEN1.8 496.02,13.89 495.88,13.89 492.79,10.79 555_TIMER_CLOCK_GEN1.4 | 555_TIMER_CLOCK_GEN1.4 491.32,6.5 C8.1 490.22,4.76 490.22,3.81 488.95,2.54 | BARREL_JACK1.TIP 14.37,18.18 17.78,21.59 17.78,24.04 VOLTAGE_REG.1 | VOLTAGE_REG.1 VOLTAGE_REG.2 | VOLTAGE_REG.1 21.18,25.81 22.86,24.13 25.08,24.13 C1.1 25.72,24.13 30.48,24.13 31.75,22.86 31.75,2.54 488.95,2.54 | RA1.2 483.6,16.78 485.14,15.24 485.14,12.7 485.8,12.04 486.66,12.04 487.02,11.68 487.02,9.55 487.68,8.89 489.41,8.89 555_TIMER_CLOCK_GEN1.4 | JP1.1 511.81,44.83 511.81,7.62 506.73,2.54 488.95,2.54
CLK  (via drill 0.35)
  Top 0.152: IC4.8 476.25,9.96 v476.25,10.16 | v452.12,22.86 450.45,21.19 IC1.1 | v463.55,22.86 473.45,22.86 v474,23.41 | v477.13,27.02 479.27,29.16 v479.34,29.16 | v481.2,31.05 482.86,32.71 v482.86,32.74 | v489.66,39.36 491.75,41.45 v493.03,41.45 | v494.93,43.22 499.55,43.22 v502.75,46.42 | v504.65,49.05 533.32,49.05 v540.74,41.63 U1.5
  Bottom 0.152: v476.25,10.16 v463.55,22.86 v452.12,22.86 | v474,23.41 477.13,26.54 v477.13,27.02 | v479.34,29.16 481.2,31.02 v481.2,31.05 | v482.86,32.74 489.48,39.36 v489.66,39.36 | v493.03,41.45 494.8,43.22 v494.93,43.22 | v502.75,46.42 504.65,48.32 v504.65,49.05
CLK_EN  (via drill 0.35)
  Top 0.152: IC4.2 480.97,7.12 481.08,7.01 481.58,7.01 481.94,7.37 481.94,7.87 481.58,8.23 480.1,8.23 IC4.4 IC4.5 481.15,9.78 v481.58,9.78 | v521.97,27.94 523.95,29.92 U1.15
  Bottom 0.152: v481.58,9.78 481.96,10.16 483.01,10.16 483.62,10.77 486.61,10.77 488.98,13.14 488.98,13.59 489.33,13.94 495.27,13.94 509.27,27.94 v521.97,27.94
CTR_MR  (via drill 0.35)
  Top 0.152: IC1.2 448.67,19.41 v448.31,19.05 | v468.63,11.43 467.56,11.43 IC3.8 | v510.54,3.81 525.22,3.81 U1.32
  Bottom 0.152: v448.31,19.05 448.72,19.05 456.95,10.82 457.81,10.82 459.74,8.89 466.09,8.89 | v468.63,11.43 466.09,8.89 | 466.09,8.89 468.63,6.35 508,6.35 v510.54,3.81
GND  (via drill 0.35)
  other vias: 50.8,361.95 181.61,346.71 36.83,45.72 39.37,19.05 24.13,8.89 228.6,6.35 346.71,6.35 472.44,26.67 461.01,7.62 467.19,10.88 527.05,19.05 552.45,24.13 548.64,15.24 500.38,261.62 431.8,275.59 340.36,287.02 260.35,255.27 214.9,217.57 157.48,228.6 72.39,236.22 22.86,205.74 86.36,179.07 175.26,308.61 115.57,118.11 326.39,153.67 369.57,267.97 353.06,392.43 369.57,365.76 172.72,293.37 332.37,301.48 337.48,298.29 181.61,293.37 186.69,293.37 184.64,289.86 259.61,27.64 262.45,20.12 260.98,11.21 271.65,9.33 278.14,10.97 274.56,22.84 285.99,8.57 292.34,21.27 291.07,27.62 242.57,21.59 243.32,27.45 245.28,11.74 344.06,11.35 341.52,21.51 360.18,11.01 394.97,11.43 384.81,262.89 381,246.38 387.35,247.65 363.13,258.14 106.68,127 350.52,381 322.58,160.02 318.02,160.81 312.41,161.38 393.7,26.67 390.51,21.76 148.59,19.05 147.76,10.12 156.17,9.52 161.89,11.14 172.71,13.26 179.11,12.04 194.85,11.2 212.63,12.47 228.56,12 331.47,152.4 340.36,139.7 351.79,156.21 342.55,27.16 90.07,189.24 327.55,11.35 337.89,9.66 231.14,92.71 261.7,93.3 377.37,11.48 386.17,9.37 167.63,26.42 180.91,21.58 316.72,26.74 325.6,27.76 309.1,27.34 308.1,21.45 311.16,11.37 160.55,26.9 164.43,19.38 332.23,169.45 373.78,22.02 373.67,27.81 332.12,159.93 289.56,264.16 289.73,253.31 289.37,238.37 289.02,224.83 403.81,9.51 213.96,19.71 211.48,27.33 418.65,23.31 431.31,21.63 432.06,12.47 426.31,27.64 503.07,4.73 192.99,20.45 192.75,27.79 420.35,9.65 223.25,22.02 231.02,30.91 368.59,23.85 358.6,27.23 477.34,14.05 474.09,9.74 387.35,62.23 404.51,60.87 419.66,58.21 217.84,225.37 196.09,220.88 232.95,221.16 201.93,206.5 233.66,194.88 488.64,22.07 398.74,73.54 405.13,72.42 142.21,27.29 405.62,28.27 107.18,183.2 171.09,188.83 195.87,185.19 450.63,13.47 452.43,7.52 170.12,161.52 64.76,211.82
  pour Top: -6.35,424.18 -6.35,-6.35 2.54,-6.35 577.85,-6.35 577.85,3.81 577.85,434.34 567.69,434.34 -6.35,434.34
  pour Bottom: -5.08,433.07 -5.08,-6.35 3.81,-6.35 574.04,-6.35 574.04,6.35 574.04,433.07 562.61,433.07 562.61,434.34 -3.81,434.34 -3.81,433.07
MUX_GROUP_01  (via drill 0.35)
  Top 0.152: v444.5,9.5 444.25,9.25 422.25,9.25 422.25,11.5 U2.6 | v466.75,6.75 471.75,11.75 479.75,11.75 481,10.5 482.5,10.5 v484,9 | v511,5.75 511.25,5.5 523.5,5.5 525.5,7.5 526.25,7.5 U1.33
  Bottom 0.152: v444.5,9.5 447.25,6.75 v466.75,6.75 | v484,9 486,7 510.25,7 510.25,6.5 v511,5.75
MUX_GROUP_02  (via drill 0.35)
  Top 0.152: v410,12.5 409.75,12.75 405.75,12.75 405.75,11.75 U3.6 | v443.75,20.75 448.25,25.25 v488.25,25.25 | v492.25,22.75 494.5,20.5 499.5,20.5 510.75,9.25 v510.75,7.5 | v511.75,6.5 512.25,6 521.25,6 522.75,7.5 523.75,7.5 U1.34
  Bottom 0.152: v410,12.5 410.75,11.75 427.5,11.75 427.5,12.25 436,20.75 v443.75,20.75 | v488.25,25.25 490.75,22.75 v492.25,22.75 | v511.75,6.5 v510.75,7.5
MUX_GROUP_03  (via drill 0.35)
  Top 0.152: v415.75,14.5 424.5,14.5 426.25,16.25 426.25,18.5 446.25,18.5 452.25,24.5 489.25,24.5 490,23.75 v490.75,23.75 | v492.25,23.75 494.25,21.75 510.5,21.75 v511,21.25 | v513,9.75 513.5,9.25 534,9.25 535.75,7.5 536.5,7.5 U1.29 | U4.6 389.25,9.75 396.24,9.75 397.45,8.54 409.79,8.54 v413.75,12.5
  Bottom 0.152: v415.75,14.5 v413.75,12.5 | v492.25,23.75 v490.75,23.75 | v511,21.25 512.25,20 512.25,10.5 v513,9.75
MUX_GROUP_04  (via drill 0.35)
  Top 0.152: v373,13.25 372.75,13.25 372.75,11.75 U5.6 | v374.75,19 394.5,19 394.75,18.75 416.5,18.75 421.75,24 430.75,24 433.25,21.5 433.25,19 441,19 448,26 489.75,26 490.25,26.5 v511,26.5 | v512.5,26.5 513.25,27.25 522.25,27.25 528,33 529,33 U1.13
  Bottom 0.152: v373,13.25 374.75,15 v374.75,19 | v512.5,26.5 v511,26.5
MUX_GROUP_05  (via drill 0.35)
  Top 0.152: v364,12.5 361.75,10.25 360,8.5 358,8.5 356.25,10.25 356.25,11.5 U6.6 | v366,33.25 366.25,33.5 v511,33.5 | v514.5,34.75 515,35.25 528.75,35.25 531,33 531.5,33 U1.12
  Bottom 0.152: v364,12.5 366,14.5 v366,33.25 | v511,33.5 512.25,34.75 v514.5,34.75
MUX_GROUP_06  (via drill 0.35)
  Top 0.152: v364.5,33.25 365.5,34.25 v509.25,34.25 | U7.6 339.75,11.5 339.75,10.25 340.26,9.73 v341.11,9.73
  Bottom 0.152: v364.5,33.25 363.25,32 363.25,30.5 363.5,30.25 363.5,23.75 363.25,23.5 363.25,11.75 350.25,11.75 348.24,9.73 v341.11,9.73 | v509.25,34.25 514.5,29 523,29 523,10 521.5,8.5 521.5,7.75 U1.35
MUX_GROUP_07  (via drill 0.35)
  Top 0.152: v338.25,4.5 338.5,4.25 447.75,4.25 v448,4.5 | U8.6 323.25,11.5 323.25,10.25 323.44,10.06 v328.51,10.06
  Bottom 0.152: v338.25,4.5 333.94,8.81 330.21,8.81 328.96,10.06 v328.51,10.06 | v448,4.5 449.5,6 468,6 471.25,2.75 516.25,2.75 516.25,2.25 517,1.5 530.75,1.5 530.75,6.5 531.5,7.25 531.5,7.5 U1.31
MUX_GROUP_08  (via drill 0.35)
  Top 0.152: v317.25,9 317.75,8.5 348.25,8.5 352,4.75 421.75,4.75 422.75,5.75 423,5.75 423.5,6.25 423.5,7.75 445.75,7.75 449,4.5 v449.25,4.5 | v453.25,5.25 454,4.5 463.5,4.5 478.5,19.5 478.5,24 484.25,24 489,19.25 489,18 489.5,17.5 497,17.5 498,18.5 498,20 499.5,20 508.25,11.25 v508.25,5 | v509.25,4 509.75,4.5 511,4.5 511.25,4.25 524.75,4.25 528,7.5 528,8.75 532,8.75 533.25,7.5 534,7.5 U1.30 | U9.6 306.75,11.5 306.75,10.25 307.39,9.61 v310.79,9.61
  Bottom 0.152: v449.25,4.5 450,5.25 v453.25,5.25 | v509.25,4 v508.25,5 | v317.25,9 312.03,9 311.42,9.61 v310.79,9.61
MUX_GROUP_09  (via drill 0.35)
  Top 0.152: v307.75,36.5 308.5,37.25 v365.25,37.25 | v366.5,36 367.5,37 v511,37 | v514.5,35.75 533,35.75 535.25,33.5 535.25,9.5 536.25,9.5 538.25,7.5 539,7.5 U1.28 | U10.6 290.25,11.5 290.25,9.47 v290.83,8.89
  Bottom 0.152: v307.75,36.5 307.75,29.5 306,27.75 306,10.5 297.15,10.5 295.31,8.65 291.07,8.65 v290.83,8.89 | v366.5,36 v365.25,37.25 | v511,37 511.75,36.25 514,36.25 v514.5,35.75
MUX_GROUP_10  (via drill 0.35)
  Top 0.152: v350.75,5 350.5,5.25 282.25,5.25 278.75,8.75 273.75,8.75 273.75,11.5 U11.6 | v352.25,5.5 421.75,5.5 v422.75,6.5 | v436.25,20 446.25,30 506.75,30 v509.5,27.25 | v517.25,2.25 517.5,2.5 536.25,2.5 541.25,7.5 541.5,7.5 U1.27
  Bottom 0.152: v350.75,5 351.25,5.5 v352.25,5.5 | v436.25,20 v422.75,6.5 | v509.5,27.25 510.25,26.5 510.25,21 511.25,20 511.25,8.25 v517.25,2.25
MUX_GROUP_11  (via drill 0.35)
  Top 0.152: v280,14 279.75,13.75 267.25,13.75 267,13.5 257.25,13.5 257.25,11.75 U12.6 | v281,8.5 281.75,7.75 v347,7.75 | v351,6.75 351.5,6.25 v421.25,6.25 | v508.25,2 509,1.25 540.75,1.25 547,7.5 U1.25
  Bottom 0.152: v280,14 281,13 v281,8.5 | v347,7.75 349,5.75 351,5.75 v351,6.75 | v421.25,6.25 426,1.5 506.75,1.5 507,1.25 507.5,1.25 v508.25,2
MUX_GROUP_12  (via drill 0.35)
  Top 0.152: v240,13 240.75,13 240.75,11.75 U13.6 | v372,78.75 v239,78.75 | v374.75,66.94 391.44,50.25 541.25,50.25 558,33.5 558,6.5 556.5,6.5 555.5,7.5 554.5,7.5 U1.22
  Bottom 0.152: v240,13 239.25,12.25 237.75,12.25 237.75,28 239,29.25 v239,78.75 | v372,78.75 374.75,76 v374.75,66.94
MUX_GROUP_13  (via drill 0.35)
  Top 0.152: v224.75,13 224.25,13 224.25,11.75 U14.6 | v228.75,9 229.5,8.25 278.25,8.25 v279,7.5 | v280,8.5 281.5,7 347.75,7 348.25,6.5 v349.25,6.5 | v350.25,7.5 362.5,7.5 362.75,7.25 420.5,7.25 421.5,8.25 446.5,8.25 450.25,4.5 v450.5,4.5 | v507.25,2 508.25,3 536,3 540.25,7.25 540.25,9.25 554.25,9.25 556,7.5 556.75,7.5 U1.21
  Bottom 0.152: v228.75,9 v224.75,13 | v280,8.5 v279,7.5 | v350.25,7.5 v349.25,6.5 | v450.5,4.5 453,2 v507.25,2
MUX_GROUP_14  (via drill 0.35)
  Top 0.152: v208.25,13 207.75,13 207.75,11.75 U15.6 | v210.25,6 211,5.25 269.75,5.25 270.25,4.75 280.75,4.75 v281.25,5.25 | v305.5,53.75 305.75,54 368.75,54 375,47.75 511.75,47.75 512.25,48.25 515,48.25 516,47.25 516,38.5 516.25,38.5 517,37.75 533.75,37.75 v534,38
  Bottom 0.152: v208.25,13 210.25,11 v210.25,6 | v281.25,5.25 287.25,11.25 303.5,11.25 303.5,29.25 304.25,30 304.25,30.5 303.5,31.25 303.5,51.75 v305.5,53.75 | v534,38 539,33 U1.9
MUX_GROUP_15  (via drill 0.35)
  Top 0.152: v200.25,12 199,13.25 191.25,13.25 191.25,11.75 U16.6 | v201.5,7 201.75,7.25 268.25,7.25 270.25,5.25 279.75,5.25 v280.5,6 | v296,37.25 299.25,40.5 371.75,40.5 373.25,39 429.5,39 430.5,38 v509.25,38 | v514.5,36.75 515,36.25 538,36.25 540,34.25 540,33.75 540.25,33.5 540.25,32.25 540,32.25 539.75,32 538.75,32 537.75,33 536.75,33 U1.10
  Bottom 0.152: v200.25,12 201.5,10.75 v201.5,7 | v280.5,6 281,6 286.75,11.75 296.25,11.75 296.25,23 296.5,23.25 296.5,27.25 296.25,27.5 296.25,31.25 296.5,31.5 296.5,34 296,34.5 v296,37.25 | v509.25,38 510.75,39.5 514.5,39.5 v514.5,36.75
MUX_GROUP_16  (via drill 0.35)
  Top 0.152: v175.25,13 174.75,13 174.75,11.75 U17.6 | v179.5,8.75 180.5,7.75 268.25,7.75 269.75,6.25 279.25,6.25 v279.5,6 | v293.5,37.25 297.25,41 367.5,41 369.5,43 426,43 430.25,38.75 v511,38.75 | v512.5,37.25 512.5,36.25 512.75,36.25 513.25,35.75 513.25,34 512.75,33.5 512.75,32 514.25,32 515.25,33 515.25,34.75 528.75,34.75 530.25,33.25 530.25,32.5 530.5,32.5 531,32 532,32 533,33 534,33 U1.11
  Bottom 0.152: v179.5,8.75 v175.25,13 | v279.5,6 287.5,14 294.5,14 294.5,26.5 293.5,27.5 v293.5,37.25 | v512.5,37.25 v511,38.75
MUX_GROUP_17  (via drill 0.35)
  Top 0.152: v170.5,34.75 177,41.25 203.25,41.25 211,49 229.5,49 234,53.5 v277,53.5 | v278.25,52.25 298.5,52.25 298.75,52 311.5,52 v311.75,52.25 | v313.25,50.75 320,44 360.5,44 361,43.5 426,43.5 427.25,42.25 508.25,42.25 v511.5,45.5 | v514.5,42.5 514.5,37.5 516,37.5 516.75,36.75 541,36.75 544.5,33.25 U1.7 | U18.6 158,11.5 158,10.25 158.75,10.25 159.85,9.15 161.4,9.15 v164.75,12.5
  Bottom 0.152: v164.75,12.5 169,16.75 169,33.25 v170.5,34.75 | v278.25,52.25 v277,53.5 | v313.25,50.75 v311.75,52.25 | v511.5,45.5 511.5,43.75 512.75,42.5 v514.5,42.5
MUX_GROUP_18  (via drill 0.35)
  Top 0.152: v194.75,9.5 194.31,9.5 193.03,8.22 181.62,8.22 180.34,9.5 174.75,9.5 173.25,8 149.86,8 148.65,6.79 138.37,6.79 137.16,8 136,8 136,11.5 141.5,11.5 141.5,10.25 U19.6 | v209.25,33.75 219.75,44.25 274,44.25 278.75,49 v286.25,49 | v288.75,51.5 314.25,51.5 316.5,49.25 v356.5,49.25 | v358.5,49.25 360.5,47.25 512,47.25 512.5,47.75 515,47.75 515.5,47.25 515.5,38.25 515.75,38.25 516.75,37.25 541,37.25 544,34.25 544.5,34.25 545.5,33.25 545.5,32.25 545,32.25 544.75,32 543.75,32 542.75,33 541.75,33 U1.8
  Bottom 0.152: v194.75,9.5 203,17.75 203,27.5 v209.25,33.75 | v288.75,51.5 v286.25,49 | v358.5,49.25 v356.5,49.25
N$1
  Top 0.152: JP1.2 513.72,33.09 U1.19
N$2  (via drill 0.35)
  Top 0.152: IC2.4 450.65,7.82 451.28,7.82 454.9,11.43 v457.2,11.43 | v462.28,11.43 462.55,11.7 IC3.5
  Bottom 0.152: v457.2,11.43 v462.28,11.43
N$3
  Top 0.152: JP3.2 491.49,22.1 492.49,21.1 R4.2 R3.1
N$4
  Top 0.152: 555_TIMER_CLOCK_GEN1.5 495.62,9.67 C6.1
N$5  (via drill 0.35)
  Top 0.152: IC3.3 464.19,12.7 463.68,13.21 v463.3,13.21 | v468.63,12.81 468.52,12.7 IC3.10
  Bottom 0.152: v463.3,13.21 463.8,12.7 468.63,12.7 v468.63,12.81
N$6  (via drill 0.35)
  Top 0.152: IC2.2 450.65,9.12 451.28,9.12 454.87,12.7 v457.2,12.7 | IC3.2 464.77,13.32 464.37,13.32 463.72,13.97 v462.28,13.97
  Bottom 0.152: v462.28,13.97 461.01,12.7 v457.2,12.7
N$7  (via drill 0.35)
  Top 0.152: R3.2 501.65,16.24 501.65,12.7 v497.84,8.89 | v488.95,10.16 490.86,12.06 555_TIMER_CLOCK_GEN1.3
  Bottom 0.152: v497.84,8.89 490.22,8.89 v488.95,10.16
N$8  (via drill 0.35)
  Top 0.152: 555_TIMER_CLOCK_GEN1.2 v489.58,13.34 488.31,14.61 488.31,15.49 489.33,16.51 499.11,16.51 500.38,15.24 500.38,13.97 498.48,12.06 555_TIMER_CLOCK_GEN1.6 | v483.87,10.16 483.55,10.48 C7.1 481.01,15.24 480.06,15.24 478.93,16.38 478.93,20.18 RB1.1
  Bottom 0.152: v489.58,13.34 489.58,12.06 486.41,8.89 485.14,8.89 v483.87,10.16
N$9  (via drill 0.35)
  Top 0.152: v500.38,16.51 499.75,17.14 489.31,17.14 RB1.2 483.6,21.32 481.33,19.05 481.33,18.05 RA1.1 | v498.98,14.48 497.84,13.34 555_TIMER_CLOCK_GEN1.7
  Bottom 0.152: v500.38,16.51 500.38,15.88 v498.98,14.48
N$10
  Top 0.152: IC3.6 465.84,10.41 466.09,10.16 468.63,10.16 469.39,10.92 469.39,11.81 469,12.2 IC3.9
N$11  (via drill 0.35)
  Top 0.152: IC4.1 480.26,6.35 482.6,6.35 486.41,10.16 v486.41,11.43 | v487.68,27.94 JP3.1
  Bottom 0.152: v486.41,11.43 486.41,26.67 v487.68,27.94
N$12  (via drill 0.35)
  Top 0.152: v417.25,31.75 417.5,32 417.83,32 418.33,32.5 428.75,32.5 IC5.1 | v417.25,18.5 417.25,16.5 U2.15
  Bottom 0.152: v417.25,18.5 v417.25,31.75
N$13  (via drill 0.35)
  Top 0.152: v282.25,214.5 275.5,214.5 275.25,214.25 258.75,214.25 256.75,216.25 250.25,216.25 250,216 243.5,216 243.25,216.25 47.5,216.25 45.5,218.25 27.17,218.25 26.67,217.75 19.55,217.75 19.05,217.25 7.35,217.25 6,215.9 6,214.75 B1G1.2 | v282.25,188.75 284.25,188.75 284.5,188.5 284.5,188.25 302.25,188.25 302.5,188 302.75,188 303,187.75 344.17,187.75 344.73,188.31 349.88,188.31 350.18,188 356.25,188 357.75,186.5 357.75,175 369.07,175 369.62,175.56 375.63,175.56 377.19,174 424.75,174 v425,174.25 | v425,31.75 428.75,31.75 IC5.2
  Bottom 0.152: v282.25,214.5 282,214.25 282,189 v282.25,188.75 | v425,31.75 v425,174.25
N$14
  Top 0.152: IC4.6 478.92,9.19 478.92,9.59 477.08,11.43 473.71,11.43 472.44,10.16 472.44,8.75 473.07,8.12 474.62,8.12 474.98,8.49 476.49,8.49 476.8,8.17 477.54,8.17 IC4.9
N$15  (via drill 0.35)
  Top 0.152: v425.25,30.5 425.25,31 425.5,31.25 428.75,31.25 IC5.3 | v425.25,22.25 424,22.25 423.75,22 423.75,19.75 420.1,19.75 419.1,18.75 418.75,18.75 418.5,18.5 418.5,16.5 U2.14
  Bottom 0.152: v425.25,22.25 v425.25,30.5
N$16  (via drill 0.35)
  Top 0.152: v283.75,188 284,187.75 302.25,187.75 302.5,187.5 302.75,187.5 303,187.25 345.44,187.25 346,187.81 349.88,187.81 350.18,187.5 356,187.5 357.25,186.25 357.25,174.5 369.32,174.5 369.87,175.06 374.37,175.06 375.92,173.5 426,173.5 426.25,173.75 426.25,174 v428.25,174 | v430.25,30.5 429,30.5 IC5.4 | B2G1.2 13.5,214.75 13.5,215.9 14.35,216.75 20.32,216.75 20.82,217.25 26.67,217.25 27.17,217.75 45.25,217.75 47,216 47,215.75 243.25,215.75 243.5,215.5 250,215.5 250.25,215.75 256.5,215.75 258.25,214 258.25,213.75 275.25,213.75 275.5,214 280.25,214 v283.75,210.5
  Bottom 0.152: v283.75,188 v283.75,210.5 | v428.25,174 428.5,173.75 428.5,173.25 428.75,173 429.5,173 429.75,172.75 429.75,172.5 430,172.25 430,30.75 v430.25,30.5
N$17  (via drill 0.35)
  Top 0.152: IC4.3 v481.33,7.62 | v476.25,7.62 IC4.10
  Bottom 0.152: v481.33,7.62 v476.25,7.62
N$18  (via drill 0.35)
  Top 0.152: v424.5,27.5 424.5,29.5 424.75,29.75 428.75,29.75 IC5.5 | v424.5,21.5 424.5,21 424.25,20.75 424.25,19.25 420.25,19.25 420,19 420,18.75 419.75,18.5 419.75,16.5 U2.13
  Bottom 0.152: v424.5,21.5 v424.5,27.5
N$19  (via drill 0.35)
  Top 0.152: v278.25,213.29 276.21,213.29 276,213.5 275.5,213.5 275.25,213.25 257.75,213.25 257.75,214 256.5,215.25 250.25,215.25 250,215 243.5,215 243.25,215.25 46.5,215.25 46.5,216 45.25,217.25 27.17,217.25 26.67,216.75 21.25,216.75 21.25,214.75 B3G1.2 | v278.25,187.5 278.5,187.25 302.25,187.25 302.5,187 302.75,187 303,186.75 345.44,186.75 346,187.31 349.88,187.31 350.18,187 355.75,187 356.75,186 356.75,174 369.57,174 370.18,174.61 374.31,174.61 375.92,173 426.5,173 v426.75,173.25 | v426.75,29 427,29.25 428.75,29.25 IC5.6
  Bottom 0.152: v278.25,187.5 v278.25,213.29 | v426.75,29 v426.75,173.25
N$20  (via drill 0.35)
  Top 0.152: v421,25.5 421.75,25.5 421.75,26.75 422,27 423,27 423.25,26.75 429,26.75 429.25,27 431,27 431,29.68 433.07,31.75 434.5,31.75 IC5.13 | v421,18.5 421,16.5 U2.12
  Bottom 0.152: v421,18.5 v421,25.5
N$21  (via drill 0.35)
  Top 0.152: v290.25,210 290,209.75 279.25,209.75 279,210 277,210 277,212 276,213 275.5,213 275.25,212.75 257.25,212.75 257.25,214 256.5,214.75 250.25,214.75 249.5,214 233.25,214 232.5,214.75 46,214.75 46,216 45.25,216.75 29.6,216.75 28.75,215.9 28.75,214.75 B4G1.2 | v290.25,203.5 290.5,203.75 338.25,203.75 338.5,203.5 350.25,203.5 350.5,203.25 381.89,203.25 382.25,202.89 385.22,202.89 386.08,203.75 429.26,203.75 430.76,202.25 v437,202.25 | v437,31.25 434.75,31.25 IC5.12
  Bottom 0.152: v290.25,203.5 v290.25,210 | v437,202.25 436.75,202 436.75,31.5 v437,31.25
N$22  (via drill 0.35)
  Top 0.152: v422.75,26.25 429,26.25 429.25,26.5 431.5,26.5 431.5,28.93 433.07,30.5 434.5,30.5 IC5.11 | v422.5,18.5 422.25,18.25 422.25,16.5 U2.11
  Bottom 0.152: v422.75,26.25 422.75,18.75 v422.5,18.5
N$23  (via drill 0.35)
  Top 0.152: v338.75,207.25 329.25,207.25 329.25,207.5 329,207.75 293.37,207.75 292.87,208.25 277.86,208.25 277.75,208.14 277.25,208.14 276.5,208.89 276.5,212 276,212.5 275.5,212.5 275.25,212.25 256.75,212.25 256.75,214 256.5,214.25 250.25,214.25 250,214 250,213.75 249.75,213.5 233.16,213.5 232.41,214.25 45.5,214.25 45.5,216 45.25,216.25 36.85,216.25 36.5,215.9 36.5,214.75 B5G1.2 | v340.25,206.25 340.5,206 352.81,206 353.06,205.75 430.53,205.75 431.53,206.75 436,206.75 v436.25,206.5 | v436.25,29.75 434.75,29.75 IC5.10
  Bottom 0.152: v338.75,207.25 339,207 339,206.5 339.25,206.25 v340.25,206.25 | v436.25,29.75 v436.25,206.5
N$24  (via drill 0.35)
  Top 0.152: v423.5,25.5 423.75,25.75 429,25.75 429.25,26 432,26 432,28.75 432.5,29.25 434.5,29.25 IC5.9 | v423.5,18.5 423.5,16.5 U2.10
  Bottom 0.152: v423.5,18.5 v423.5,25.5
N$25  (via drill 0.35)
  Top 0.152: v227,209.75 224.75,209.75 224.75,213 224.5,213.25 173.25,213.25 172.75,213.75 44,213.75 44,214.5 B6G1.2 | v227,175.25 227.25,175.5 229.37,175.5 229.87,176 240.03,176 243.03,173 253.25,173 253.5,172.75 253.5,170.5 256.75,170.5 257,170.25 285,170.25 285.25,170 285.75,170 286,169.75 286,169 298,169 v298.25,169.25 | v298.25,136.25 307.75,136.25 308,136 319.68,136 320.68,135 335.25,135 335.5,134.75 338,134.75 338.25,134.5 410.07,134.5 410.37,134.81 415.3,134.81 419.1,131 423,131 423.25,130.75 424.5,130.75 424.75,130.5 424.75,128.25 432.25,128.25 v432.5,128.5 | v432.75,28.5 434.5,28.5 IC5.8
  Bottom 0.152: v227,209.75 226.75,209.5 226.75,175.5 v227,175.25 | v298.25,136.25 v298.25,169.25 | v432.5,128.5 432.75,128.25 v432.75,28.5
N$26
  Top 0.152: IC6.1 428.75,23.5 426.75,23.5 426.28,23.03 426.28,22.03 426.25,22 426.25,21 425,21 424.75,20.75 424.75,16.5 U2.9
N$27  (via drill 0.35)
  Top 0.152: v58.5,209.75 58.25,210 54.5,210 53.25,211.25 52,211.25 51.75,211.5 B7G1.2 | v58.5,71.25 133.25,71.25 133.5,71 142.75,71 143.75,70 155.25,70 155.5,69.75 182.88,69.75 185.13,72 187.14,72 187.75,72.61 188.57,72.61 189.18,72 192.18,72 192.68,71.5 225.32,71.5 226.12,72.31 227.63,72.31 227.93,72 254.77,72 255.27,71.5 274.57,71.5 275.57,72.5 326.66,72.5 327.66,71.5 348.82,71.5 349.12,71.81 352.13,71.81 352.43,71.5 360.5,71.5 v360.75,71.75 | v360.75,55.75 361,55.5 369.75,55.5 370,55.75 371.75,55.75 373.5,54 386,54 386.75,53.25 386.75,49.53 387.53,48.75 420.37,48.75 420.87,49.25 430.75,49.25 v431,49.5 | v430.75,23 429,23 IC6.2
  Bottom 0.152: v58.5,71.25 v58.5,209.75 | v360.75,55.75 v360.75,71.75 | v431,49.5 431,23.25 v430.75,23
N$28  (via drill 0.35)
  Top 0.152: v425.5,20.25 426.75,20.25 426.75,22 427,22.25 428.75,22.25 IC6.3 | v425.25,13.5 423.75,13.5 423.5,13.25 423.5,11.75 U2.7
  Bottom 0.152: v425.5,20.25 425.25,20 v425.25,13.5
N$29  (via drill 0.35)
  Top 0.152: v187.99,192.87 185.61,195.25 141.68,195.25 141.18,194.75 95.48,194.75 93.98,196.25 85,196.25 81.75,199.5 77,199.5 77,199.75 74,202.75 69,202.75 69,203.5 66.5,206 61,206 61,207.25 60.75,207.5 59.5,207.5 59.25,207.75 B8G1.2 | v188,72 188.25,71.75 189,71.75 189.25,71.5 192.18,71.5 192.68,71 225.89,71 226.75,71.86 227.25,71.86 227.61,71.5 254.77,71.5 255.27,71 275.07,71 276.07,72 326.66,72 327.66,71 349.07,71 349.37,71.31 352.13,71.31 352.43,71 361.5,71 v361.75,71.25 | v361.75,45.75 427.25,45.75 427.5,45.5 v427.5,43 | v427.5,21.5 428.75,21.5 IC6.4
  Bottom 0.152: v187.99,192.87 187.99,72.01 v188,72 | v361.75,45.75 v361.75,71.25 | v427.5,21.5 v427.5,43
N$30  (via drill 0.35)
  Top 0.152: v395,19.5 395,22.5 394,23.5 393.5,23.5 IC10.3 | v393.5,12.5 393.25,12.75 391.25,12.75 390.5,12 390.5,11.75 U4.7
  Bottom 0.152: v395,19.5 393.5,18 v393.5,12.5
N$31  (via drill 0.35)
  Top 0.152: v411.25,32.25 411,32.5 410,32.5 IC7.1 | v411.25,17.5 411,17.75 401,17.75 400.75,17.5 400.75,16.5 U3.15
  Bottom 0.152: v411.25,17.5 v411.25,32.25
N$32  (via drill 0.35)
  Top 0.152: v264,188 263.75,188.25 252.73,188.25 250.73,190.25 179.26,190.25 175.26,194.25 161.29,194.25 160.79,194.75 142.24,194.75 141.74,194.25 94.21,194.25 92.71,195.75 85,195.75 81.75,199 76.5,199 76.5,199.75 74,202.25 68.5,202.25 68.5,203.5 68.25,203.75 67.25,203.75 67,204 B1G2.2 | v264,114 283,114 283.25,114.25 283.25,114.5 345.44,114.5 346.94,113 362.75,113 363.5,113.75 v402,113.75 | v402,32 402.25,31.75 409.75,31.75 IC7.2
  Bottom 0.152: v264,188 264.25,187.75 264.25,183.75 264,183.5 264,182.5 263.75,182.25 263.75,114.25 v264,114 | v402,113.75 401.75,113.5 401.75,32.25 v402,32
N$33  (via drill 0.35)
  Top 0.152: v402,30.5 402,31 402.25,31.25 409.75,31.25 IC7.3 | v402.25,14.75 402,15 402,16.25 U3.14
  Bottom 0.152: v402,30.5 402,15 v402.25,14.75
N$34  (via drill 0.35)
  Top 0.152: v296.75,162.25 296.5,162.5 271.51,162.5 270.51,161.5 246.5,161.5 246.25,161.75 226,161.75 226,161.5 225.75,161.25 179.25,161.25 179.25,162 179,162.25 178.75,162.25 178.5,162.5 166.75,162.5 166.5,162.25 166,162.25 166,161.5 165.75,161.25 116.75,161.25 116.5,161.5 116.25,161.5 116,161.75 116,183.15 115,184.15 115,187.25 114.25,188 99,188 99,190.75 98.5,191.25 95.25,191.25 95.25,192.25 95,192.5 94.75,192.5 94.5,192.75 92.75,192.75 92.75,195 92.5,195.25 84.8,195.25 81.55,198.5 76,198.5 76,199.75 75.75,200 74.75,200 74.5,200.25 B2G2.2 | v296.75,134 297,133.75 307.75,133.75 308,133.5 318.75,133.5 319.25,134 335.25,134 335.5,133.75 338,133.75 338.25,133.5 409.25,133.5 409.5,133.25 v409.5,132.25 | v412,30.5 410,30.5 IC7.4
  Bottom 0.152: v296.75,162.25 297,162 297,134.25 v296.75,134 | v409.5,132.25 409.5,40.75 409.75,40.5 410,40.5 410.25,40.25 410.5,40.25 410.75,40 411,40 411.25,39.75 411.75,39.75 412,39.5 v412,30.5
N$35  (via drill 0.35)
  Top 0.152: v403.25,14.75 403.25,16.25 U3.13 | IC7.5 409.75,29.75 408.94,29.75 408.83,29.86 405.96,29.86 403.25,27.16 v403.25,25.5
  Bottom 0.152: v403.25,14.75 v403.25,25.5
N$36  (via drill 0.35)
  Top 0.152: v295.75,151 295.75,153.25 295.5,153.5 274,153.5 273.75,153.75 271,153.75 270.75,154 269.5,154 269.5,155.25 269.25,155.5 260.35,155.5 259.85,155 248.92,155 247.17,156.75 115.5,156.75 115.25,156.5 109.25,156.5 109.25,158.5 109.5,158.75 113.75,158.75 113.75,175.75 113.5,176 111.75,176 111.75,181.75 111.5,182 102.25,182 102.25,186.25 102,186.5 87,186.5 87,191.77 82.77,196 82.5,196 82.25,196.25 B3G2.2 | v295.75,132.5 296,132.25 296.25,132.25 296.5,132 296.75,132 297,131.75 307.75,131.75 308,131.5 335.25,131.5 335.5,131.25 338,131.25 338.25,131 393.7,131 395.77,133.07 404.06,133.07 405.13,132 407,132 v407.25,132.25 | v407.75,29 408,29.25 409.75,29.25 IC7.6
  Bottom 0.152: v295.75,132.5 v295.75,151 | v407.25,132.25 407.25,29.25 407.5,29 v407.75,29
N$37  (via drill 0.35)
  Top 0.152: v404.5,14.75 404.5,16.25 U3.12 | IC7.13 415.5,31.75 414.25,31.75 411.75,29.25 411.75,27.75 410.5,27.75 410.25,27.5 406.5,27.5 v404.5,25.5
  Bottom 0.152: v404.5,14.75 v404.5,25.5
N$38  (via drill 0.35)
  Top 0.152: v287.75,155.75 287.5,155.5 274,155.5 273.75,155.75 271.78,155.75 270.03,157.5 258.82,157.5 258.32,157 250.43,157 248.68,158.75 236,158.75 233.5,161.25 226.25,161.25 226.25,161 226,160.75 116.25,160.75 116.25,161 116,161.25 115.75,161.25 115.5,161.5 115.5,181.88 114.5,182.88 114.5,187 114,187.5 98.5,187.5 98.5,190.5 98.25,190.75 94.75,190.75 94.75,192 94.5,192.25 90,192.25 89.75,192.5 B4G2.2 | v288,134.75 288.25,135 296.75,135 297,134.75 298.25,134.75 298.75,134.25 307.75,134.25 308,134 317.5,134 318,134.5 335.25,134.5 335.5,134.25 338,134.25 338.25,134 414.33,134 417.83,130.5 423,130.5 423.25,130.25 423.75,130.25 v424,130 | v424,31 423,31 422.75,30.75 417,30.75 416.75,31 416.75,31.25 415.75,31.25 IC7.12
  Bottom 0.152: v287.75,155.75 287.75,135 v288,134.75 | v424,31 v424,130
N$39  (via drill 0.35)
  Top 0.152: v405.75,25.5 406,25.5 406,25.75 406.25,26 406.5,26 406.5,26.25 407.25,27 410.25,27 410.5,27.25 412.25,27.25 412.25,29 413.75,30.5 415.5,30.5 IC7.11 | v405.75,14.75 405.75,16.25 U3.11
  Bottom 0.152: v405.75,14.75 v405.75,25.5
N$40  (via drill 0.35)